# Altium schematic sheet HORN_DAC.SchDoc
size A; SheetNumber: 8; SheetTotal: 8
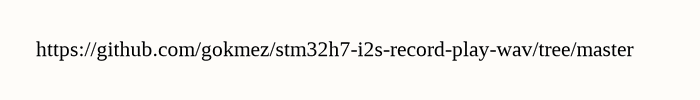
[diagram p0: HORN_DAC.SchDoc]

## Notes on the sheet
- https://github.com/gokmez/stm32h7-i2s-record-play-wav/tree/master